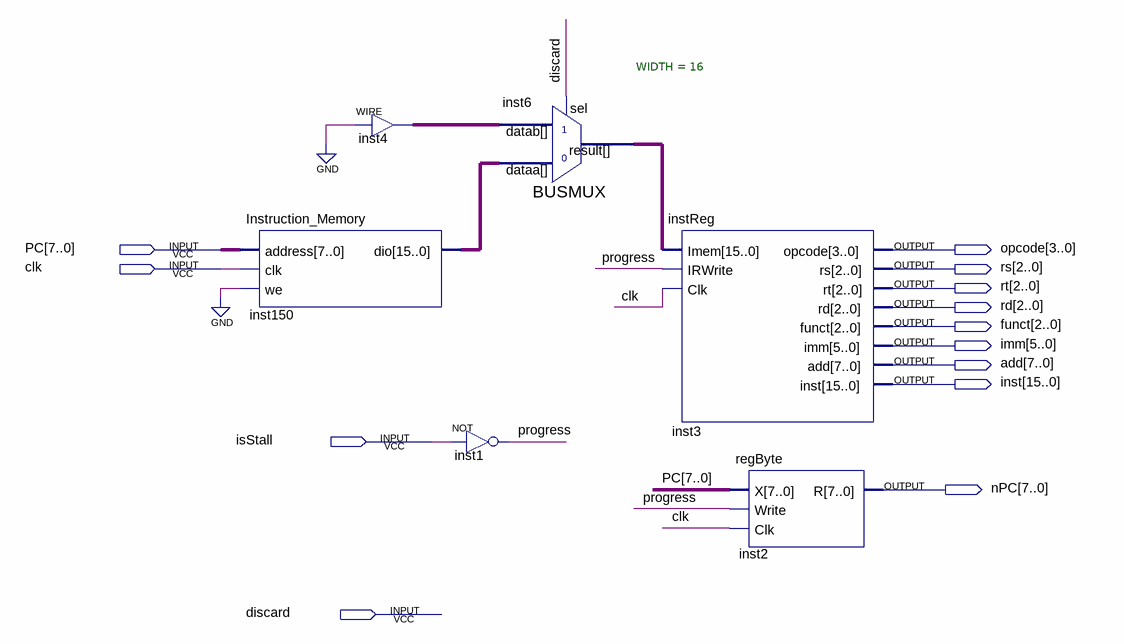
[diagram p0: schematic sheet]
// Quartus schematic InstFetchCycle.bdf as structural Verilog: 6 symbols, 13 pins
module InstFetchCycle (
  input  [7:0] PC,
  input  clk,
  input  isStall,
  input  discard,
  output [3:0] opcode,
  output [2:0] rs,
  output [2:0] rt,
  output [2:0] rd,
  output [2:0] funct,
  output [5:0] imm,
  output [7:0] add,
  output [15:0] inst,
  output [7:0] nPC
);

  wire progress;
  wire [15:0] inst4_out, inst6_result, inst150_dio;

  Instruction_Memory inst150 (.address(PC), .clk(clk), .we(1'b0), .dio(inst150_dio));
  assign inst4_out = {16{1'b0}};  // WIRE inst4
  BUSMUX #(.WIDTH(16)) inst6 (.datab(inst4_out), .sel(discard), .dataa(inst150_dio), .result(inst6_result));
  not inst1 (progress, isStall);
  instReg inst3 (
    .Imem(inst6_result), .IRWrite(progress), .Clk(clk), .opcode(opcode), .rs(rs), .rt(rt), .rd(rd),
    .funct(funct), .imm(imm), .add(add), .inst(inst));
  regByte inst2 (.X(PC), .Write(progress), .Clk(clk), .R(nPC));
endmodule
